# EAGLE design 12-5Convertor (EAGLE 7.3.0)
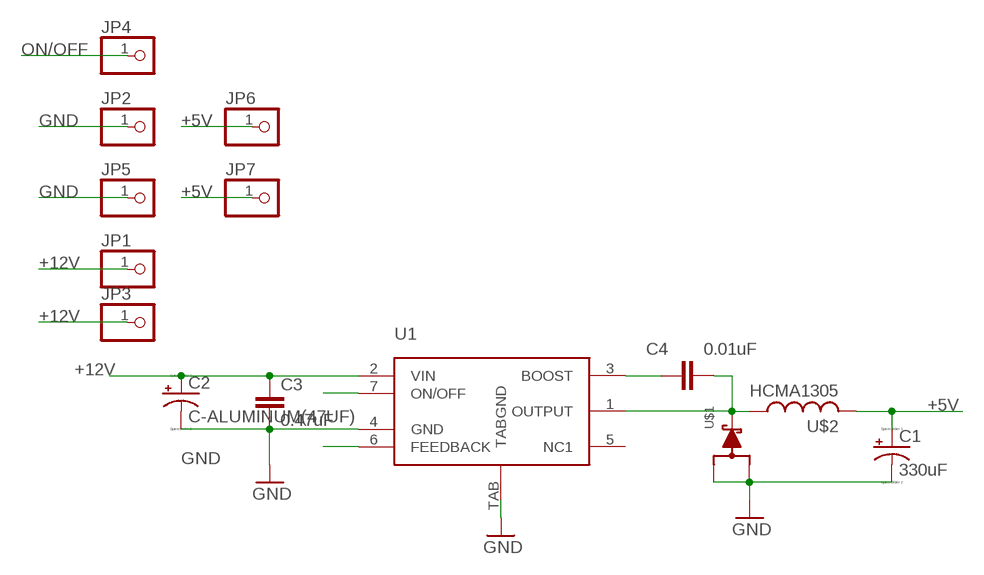
[diagram p0: schematic, sheet 1]

## Parts
C1  330uF  C-ALUMINUM(330UF)  [CPOL-US(10.3_10.3MM)]
C2  C-ALUMINUM(47UF)  [CPOL-US(8.3_8.3MM)]
C3  0.47uF  CAP0805  [0805]
C4  0.01uF  CAP0603-CAP  [0603-CAP]
JP1  PINHD-1X1  [1X01]
JP2  PINHD-1X1  [1X01]
JP3  PINHD-1X1  [1X01]
JP4  PINHD-1X1  [1X01]
JP5  PINHD-1X1  [1X01]
JP6  PINHD-1X1  [1X01]
JP7  PINHD-1X1  [1X01]
U1  LM2678  [LM2678]
U$1  SWITCHMODE_SCHOTTKY  [DPAK-3]
U$2  HCMA1305  [HCMA1305]

## Nets
+5V: C1.+ JP6.1 JP7.1 U1.6(FEEDBACK) U$2.P$2
+12V: C2.+ C3.1 JP1.1 JP3.1 U1.2(VIN)
GND: C1.- C2.- C3.2 JP2.1 JP5.1 U1.4(GND) U1.TAB(TABGND) U$1.P$1 U$1.P$3
N$2: C4.1 U1.3(BOOST)
N$3: C4.2 U1.1(OUTPUT) U$1.P$4 U$2.P$1
ON/OFF: JP4.1 U1.7(ON/OFF)
Unconnected: U1.5(NC1)

## Library data of the parts
C1 = PowerComponents:C-ALUMINUM(330UF)
C2 = PowerComponents:C-ALUMINUM(47UF)
C3 = SparkFun-Capacitors:CAP: Capacitor Standard 0603 ceramic capacitor, and 0.1" leaded capacitor.
C4 = SparkFun-Passives:CAP: Capacitor Standard 0603 ceramic capacitor, and 0.1" leaded capacitor.
JP1-JP7 = pinhead:PINHD-1X1: PIN HEADER
U1 = PowerComponents:LM2678: LM2678 Buck Converter IC 12V-to-5V
U$1 = PowerComponents:SWITCHMODE_SCHOTTKY: {Digi-Key Part Number: MBRD835LT4GOSCT-ND} {Voltage - DC Reverse (Vr) (Max): 35V} {Current - Average Rectified (Io): 8A} {Voltage - Forward (Vf) (Max) @ If: 510mV @ 8A} {Speed: Fast Recovery =< 500ns, > 200mA (Io)} {Current - Reverse Leakage @ Vr: 1.4mA @ 35V} {Mounting Type: Surface Mount} {Package / Case: TO-252-3, DPak (2 Leads + Tab), SC-63} {Supplier Device Package: DPAK-3} {Operating Temperature - Junction: -65°C ~ 150°C}
U$2 = DiscreteComponents:HCMA1305

## Board
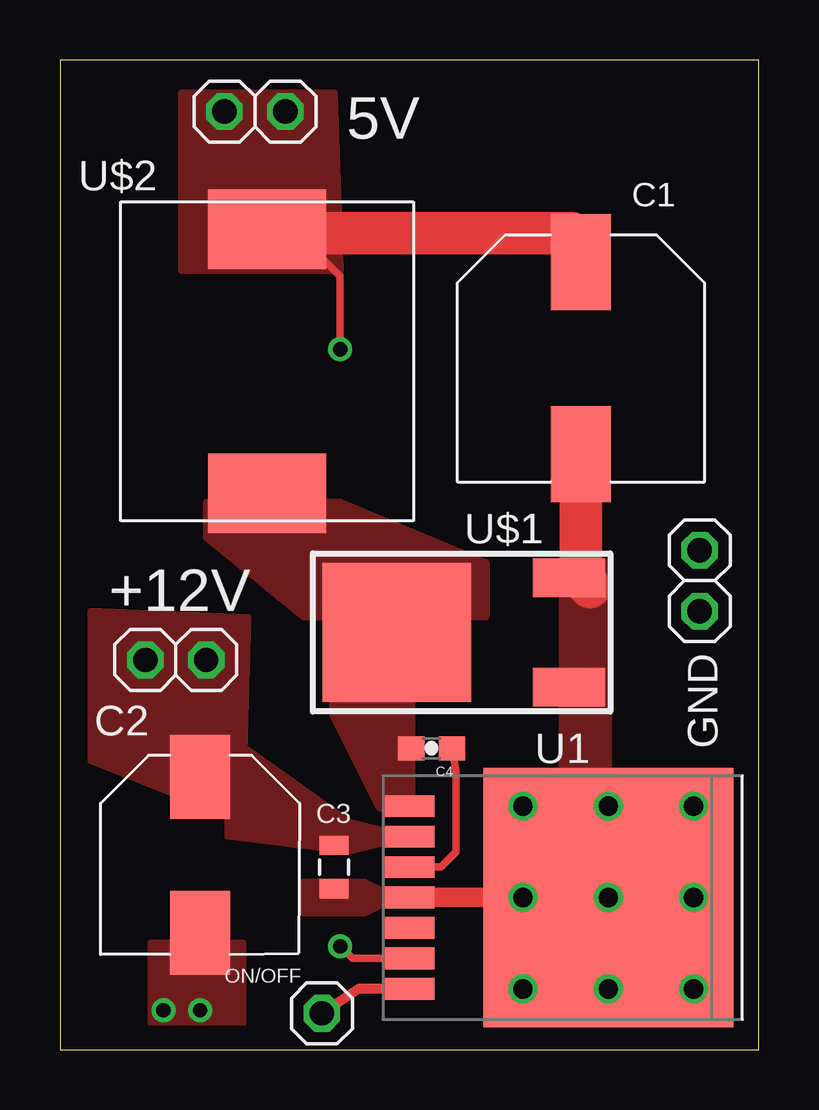
[diagram p1: board, top side]
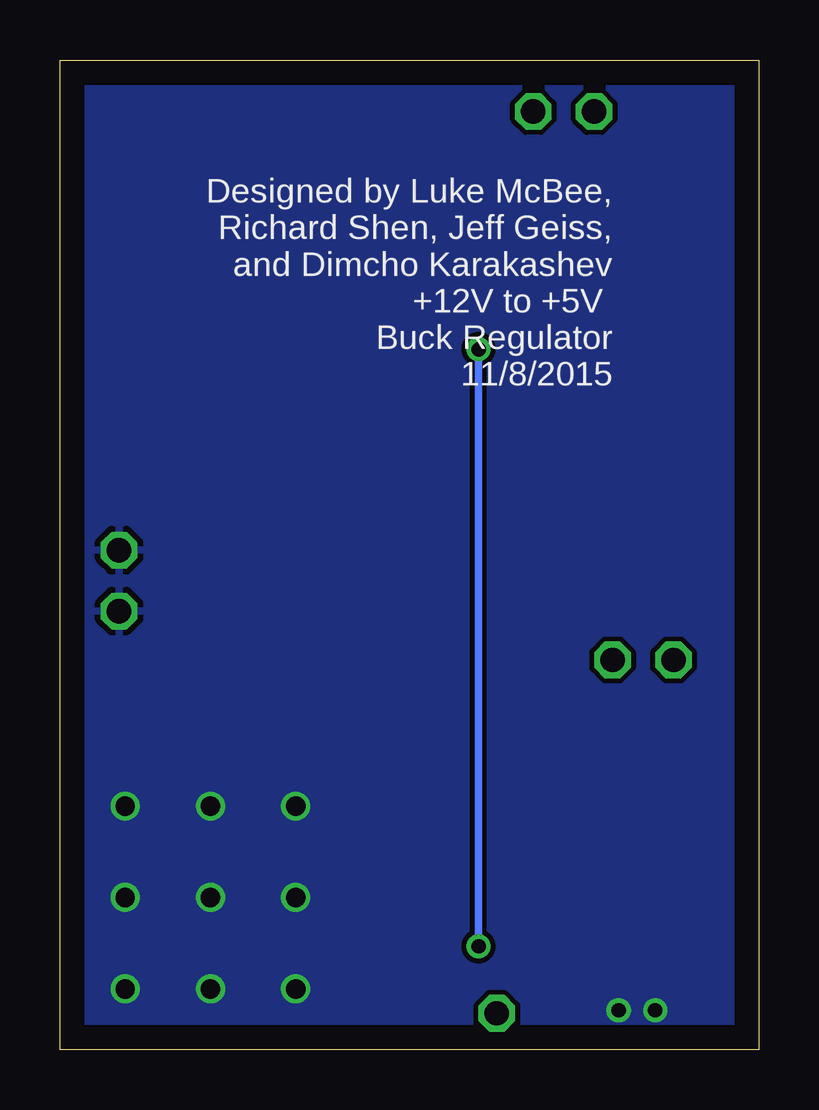
[diagram p2: board, bottom side, seen from below]

Size 29.13 x 41.27 mm. Coordinates in mm from the lower left corner, seen from the top.
Outline: 0,0 29.13,0 29.13,41.27 0,41.27 0,0
Copper layers (1*16): Top 0.035mm / dielectric 1.5mm / Bottom 0.035mm
Design rules "default": minimum track width 10mil, minimum drill 24mil, track to track 8mil, track to pad 8mil, pad to pad 8mil, via to via 8mil, smd to smd 8mil, copper to edge 40mil, drill to drill 8mil, minimum pad ring 10mil, minimum via ring 8mil, stop-mask expansion 4mil, vias tented up to drill 0mil, thermal gap 10mil

### Footprints (pad centres in the part's own frame; a part is rotated, then mirrored left to right if it is on the bottom)
CPOL-US(10.3_10.3MM) = smd 2.5 x 4: + 0,4; - 0,-4
CPOL-US(8.3_8.3MM) = smd 2.5 x 3.5: + 0,3.25; - 0,-3.25
0805 = smd 0.8 x 1.2: 1 -0.9,0; 2 0.9,0
0603-CAP = smd 1.1 x 1: 1 -0.85,0; 2 0.85,0
1X01 = drill 1.016 octagon: 1 0,0
LM2678 = smd 2.159 x 0.914: 1 8.331,-3.81; 2 8.331,-2.54; 3 8.331,-1.27; 4 8.331,0; 5 8.331,1.27; 6 8.331,2.54; 7 8.331,3.81 | smd 10.414 x 10.795: TAB 0,0
DPAK-3 = smd 3 x 1.6: P$1 4.08,-2.285; P$3 4.08,2.285 | smd 6.2 x 5.8: P$4 -3.1,0
HCMA1305 = smd 4.9 x 3.3: P$1 0,5.5; P$2 0,-5.5

### Placement (x,y rotation side)
C1  21.72,28.83 0 top
C2  5.84,8.13 0 top
C3  11.43,7.62 270 top
C4  15.49,12.57 180 top
JP1  3.56,16.26 0 top
JP2  26.67,18.29 0 top
JP3  6.1,16.26 0 top
JP4  10.92,1.52 0 top
JP5  26.67,20.83 0 top
JP6  9.4,39.12 0 top
JP7  6.86,39.12 0 top
U1  22.86,6.35 180 top
U$1  17.15,17.4 0 top
U$2  8.64,28.7 180 top

### Tracks (layer width: path | path; a pad name or v marks a point on that pad's centre or on a via)
+5V  (via drill 0.6)
  Top 0.305: U1.6 12.19,3.81 v11.68,4.32 | v11.68,29.21 11.68,32.26 10.41,33.53 9.91,33.53 9.52,33.91
  Top 0.406: 21.72,33.66 21.08,33.66 20.57,34.04 20.83,34.04 20.83,34.54 22.35,34.54 22.35,33.53 21.72,33.53 C1.+ | 9.23,33.78 8.89,33.78
  Top 1.778: 21.72,33.66 21.34,34.04 20.57,34.04 9.65,34.04 | 9.65,34.04 9.52,33.91 9.4,33.78 9.23,33.78 | 9.65,34.04 9.65,34.29
  Bottom 0.305: v11.68,4.32 v11.68,29.21
  pour Top (no thermals): 5.08,39.88 11.43,39.88 11.68,32.51 5.08,32.51
+12V
  pour Top (no thermals): 7.62,12.7 12.06,9.52 14.6,8.89 12.06,8.25 6.98,8.89 6.98,12.7
  pour Top (no thermals): 7.62,9.52 7.87,18.03 1.27,18.29 1.27,12.06
GND  (via drill 0.6, 0.8)
  Top 0.813: U1.4 v19.3,6.35
  Top 1.778: C1.- 21.72,19.69 22.1,19.3
  other vias: 22.86,6.35 19.3,2.54 19.3,10.16 22.86,2.54 26.42,2.54 26.42,6.35 26.42,10.16 22.86,10.16 4.32,1.65 5.84,1.65
  pour Bottom: -1.27,-5.08 34.29,-5.08 34.29,50.8 -1.27,50.8
  pour Top (no thermals): 20.95,20.32 20.95,11.43 22.86,11.43 22.86,20.32
  pour Top (no thermals): 13.97,6.35 12.7,6.98 10.16,6.98 10.16,6.35 10.16,5.71 12.7,5.71
  pour Top (no thermals): 3.81,4.45 3.81,0.63 7.62,0.63 7.62,4.45
N$2
  Top 0.305: U1.3 15.88,7.62 16.51,8.25 16.51,11.64 C4.1
N$3
  pour Top (no thermals): 11.43,13.97 13.34,10.16 14.6,10.16 14.6,14.6 11.43,14.6
  pour Top (no thermals): 6.1,22.86 11.68,22.86 17.78,20.32 17.78,18.03 10.16,18.03 6.1,21.34
ON/OFF
  Top 0.406: U1.7 12.45,2.54 JP4.1

### Text on the board
tPlace: 5V | +12V | GND | ON/OFF
bPlace: Designed by Luke McBee, / Richard Shen, Jeff Geiss, / and Dimcho Karakashev / +12V to +5V / Buck Regulator / 11/8/2015